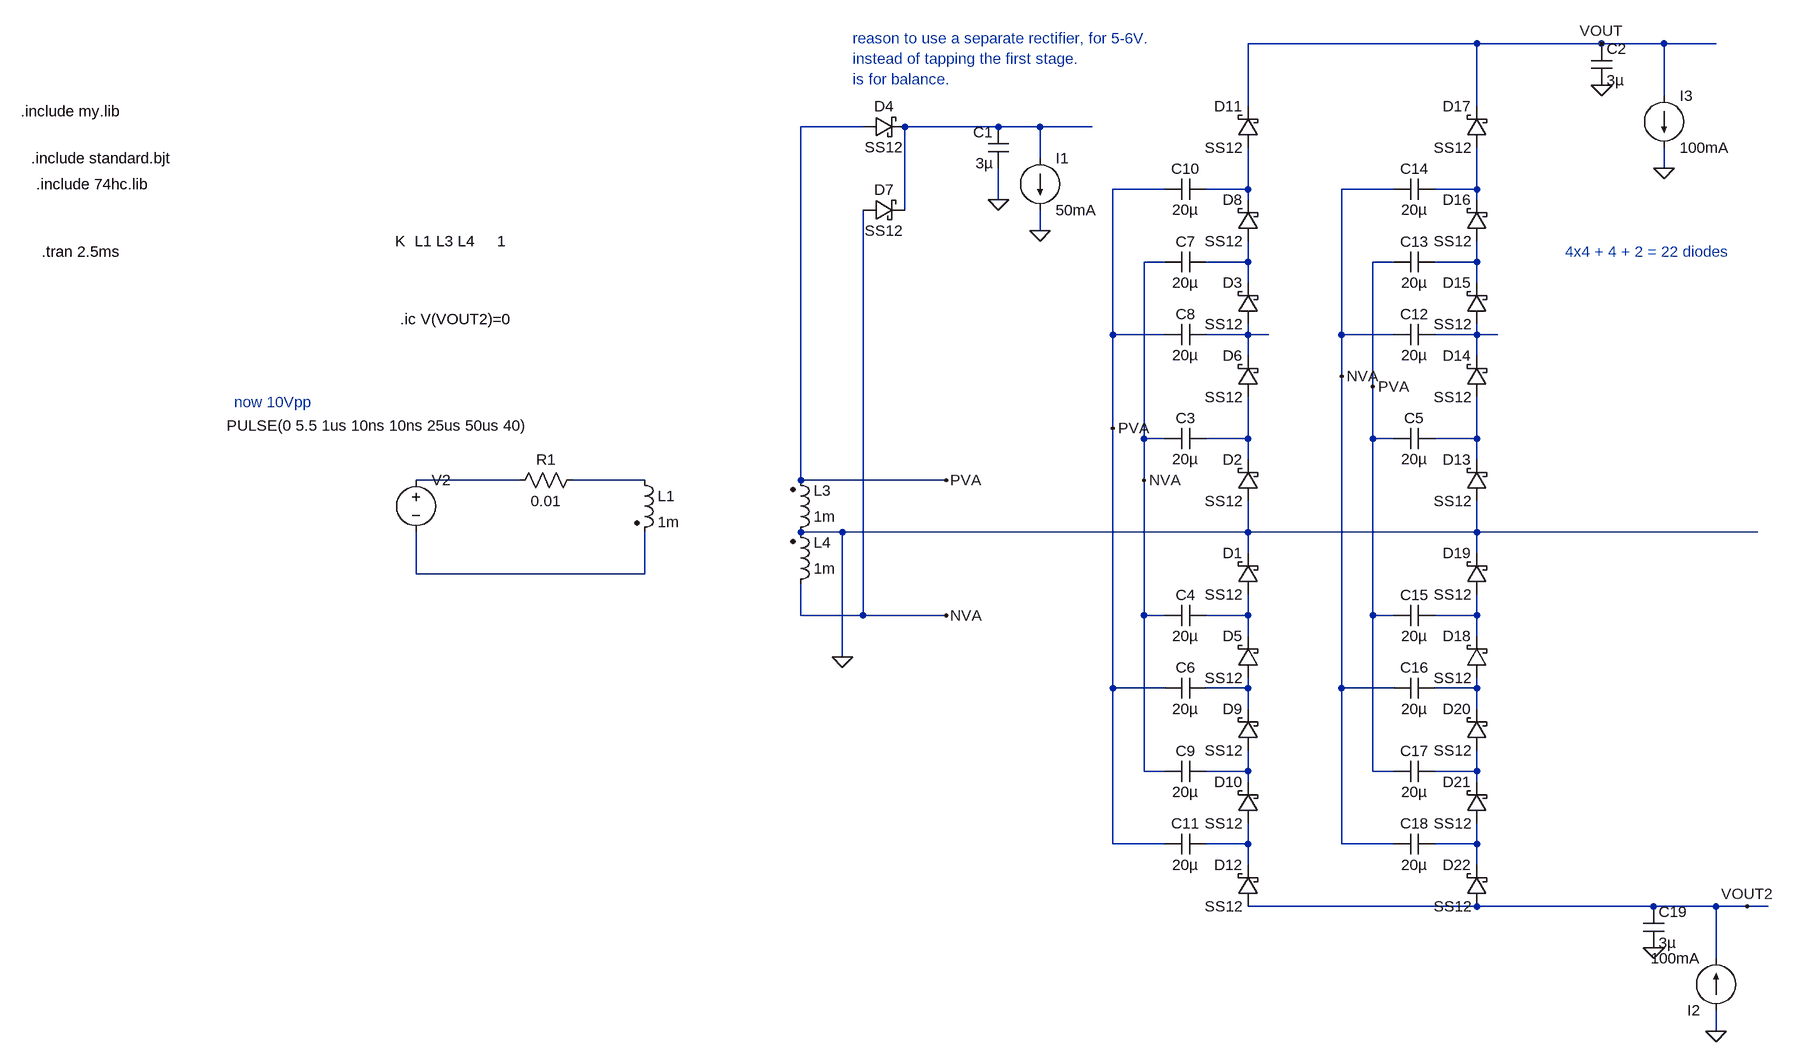
[diagram p0: schematic Draft103.asc]
Draft103.asc, the LTspice schematic file:
Version 4
SHEET 1 5720 1740
WIRE 2784 -800 2432 -800
WIRE 2976 -800 2784 -800
WIRE 3072 -800 2976 -800
WIRE 3152 -800 3072 -800
WIRE 3072 -720 3072 -800
WIRE 2432 -704 2432 -800
WIRE 2784 -704 2784 -800
WIRE 1840 -672 1744 -672
WIRE 2048 -672 1904 -672
WIRE 2112 -672 2048 -672
WIRE 2192 -672 2112 -672
WIRE 2112 -624 2112 -672
WIRE 3072 -608 3072 -640
WIRE 2304 -576 2224 -576
WIRE 2432 -576 2432 -640
WIRE 2432 -576 2368 -576
WIRE 2656 -576 2576 -576
WIRE 2784 -576 2784 -640
WIRE 2784 -576 2720 -576
WIRE 2048 -560 2048 -608
WIRE 2432 -560 2432 -576
WIRE 2784 -560 2784 -576
WIRE 1904 -544 1904 -672
WIRE 2112 -512 2112 -544
WIRE 2304 -464 2272 -464
WIRE 2432 -464 2432 -496
WIRE 2432 -464 2368 -464
WIRE 2656 -464 2624 -464
WIRE 2784 -464 2784 -496
WIRE 2784 -464 2720 -464
WIRE 2432 -432 2432 -464
WIRE 2784 -432 2784 -464
WIRE 2224 -352 2224 -576
WIRE 2304 -352 2224 -352
WIRE 2432 -352 2432 -368
WIRE 2432 -352 2368 -352
WIRE 2464 -352 2432 -352
WIRE 2576 -352 2576 -576
WIRE 2656 -352 2576 -352
WIRE 2784 -352 2784 -368
WIRE 2784 -352 2720 -352
WIRE 2816 -352 2784 -352
WIRE 2432 -320 2432 -352
WIRE 2784 -320 2784 -352
WIRE 2576 -288 2576 -352
WIRE 2624 -272 2624 -464
WIRE 2224 -208 2224 -352
WIRE 2272 -192 2272 -464
WIRE 2304 -192 2272 -192
WIRE 2432 -192 2432 -256
WIRE 2432 -192 2368 -192
WIRE 2624 -192 2624 -272
WIRE 2656 -192 2624 -192
WIRE 2784 -192 2784 -256
WIRE 2784 -192 2720 -192
WIRE 2432 -160 2432 -192
WIRE 2784 -160 2784 -192
WIRE 1312 -128 1152 -128
WIRE 1504 -128 1392 -128
WIRE 1744 -128 1744 -672
WIRE 1968 -128 1744 -128
WIRE 2272 -128 2272 -192
WIRE 1808 -48 1744 -48
WIRE 2432 -48 2432 -96
WIRE 2432 -48 1808 -48
WIRE 2784 -48 2784 -96
WIRE 2784 -48 2432 -48
WIRE 3216 -48 2784 -48
WIRE 2432 -16 2432 -48
WIRE 2784 -16 2784 -48
WIRE 1152 16 1152 -48
WIRE 1504 16 1504 -48
WIRE 1504 16 1152 16
WIRE 1744 80 1744 32
WIRE 1840 80 1840 -544
WIRE 1840 80 1744 80
WIRE 1968 80 1840 80
WIRE 2272 80 2272 -128
WIRE 2304 80 2272 80
WIRE 2432 80 2432 48
WIRE 2432 80 2368 80
WIRE 2624 80 2624 -192
WIRE 2656 80 2624 80
WIRE 2784 80 2784 48
WIRE 2784 80 2720 80
WIRE 2432 112 2432 80
WIRE 2784 112 2784 80
WIRE 1808 144 1808 -48
WIRE 2224 192 2224 -208
WIRE 2304 192 2224 192
WIRE 2432 192 2432 176
WIRE 2432 192 2368 192
WIRE 2576 192 2576 -288
WIRE 2656 192 2576 192
WIRE 2784 192 2784 176
WIRE 2784 192 2720 192
WIRE 2432 224 2432 192
WIRE 2784 224 2784 192
WIRE 2272 320 2272 80
WIRE 2304 320 2272 320
WIRE 2432 320 2432 288
WIRE 2432 320 2368 320
WIRE 2624 320 2624 80
WIRE 2656 320 2624 320
WIRE 2784 320 2784 288
WIRE 2784 320 2720 320
WIRE 2432 336 2432 320
WIRE 2784 336 2784 320
WIRE 2224 432 2224 192
WIRE 2304 432 2224 432
WIRE 2432 432 2432 400
WIRE 2432 432 2368 432
WIRE 2576 432 2576 192
WIRE 2656 432 2576 432
WIRE 2784 432 2784 400
WIRE 2784 432 2720 432
WIRE 2432 464 2432 432
WIRE 2784 464 2784 432
WIRE 2784 528 2432 528
WIRE 3056 528 2784 528
WIRE 3152 528 3056 528
WIRE 3200 528 3152 528
WIRE 3232 528 3200 528
WIRE 3152 608 3152 528
WIRE 3152 720 3152 688
FLAG 1808 144 0
FLAG 2976 -800 VOUT
FLAG 3072 -608 0
FLAG 2048 -560 0
FLAG 2112 -512 0
FLAG 2976 -736 0
FLAG 1968 -128 PVA
FLAG 2224 -208 PVA
FLAG 1968 80 NVA
FLAG 2272 -128 NVA
FLAG 2624 -272 PVA
FLAG 2576 -288 NVA
FLAG 3152 720 0
FLAG 3056 592 0
FLAG 3200 528 VOUT2
SYMBOL ind2 1728 -32 M180
WINDOW 0 36 80 Left 2
WINDOW 3 36 40 Left 2
SYMATTR InstName L3
SYMATTR Value 1m
SYMATTR Type ind
SYMBOL ind2 1728 48 M180
WINDOW 0 36 80 Left 2
WINDOW 3 36 40 Left 2
SYMATTR InstName L4
SYMATTR Value 1m
SYMATTR Type ind
SYMBOL ind2 1488 -144 R0
SYMATTR InstName L1
SYMATTR Value 1m
SYMATTR Type ind
SYMBOL voltage 1152 -144 R0
WINDOW 123 0 0 Left 0
WINDOW 39 0 0 Left 0
WINDOW 3 -291 -68 Left 2
SYMATTR Value PULSE(0 5.5 1us 10ns 10ns 25us 50us 40)
SYMATTR InstName V2
SYMBOL cap 2368 -208 R90
WINDOW 0 0 32 VBottom 2
WINDOW 3 32 32 VTop 2
SYMATTR InstName C3
SYMATTR Value 20µ
SYMBOL cap 2368 64 R90
WINDOW 0 0 32 VBottom 2
WINDOW 3 32 32 VTop 2
SYMATTR InstName C4
SYMATTR Value 20µ
SYMBOL current 3072 -720 R0
WINDOW 123 0 0 Left 0
WINDOW 39 0 0 Left 0
SYMATTR InstName I3
SYMATTR Value 100mA
SYMBOL schottky 2448 -96 R180
WINDOW 0 24 64 Left 2
WINDOW 3 24 0 Left 2
SYMATTR InstName D2
SYMATTR Value SS12
SYMATTR Description Diode
SYMATTR Type diode
SYMBOL schottky 2448 176 R180
WINDOW 0 24 64 Left 2
WINDOW 3 24 0 Left 2
SYMATTR InstName D5
SYMATTR Value SS12
SYMATTR Description Diode
SYMATTR Type diode
SYMBOL schottky 2448 48 R180
WINDOW 0 24 64 Left 2
WINDOW 3 24 0 Left 2
SYMATTR InstName D1
SYMATTR Value SS12
SYMATTR Description Diode
SYMATTR Type diode
SYMBOL schottky 2448 -256 R180
WINDOW 0 24 64 Left 2
WINDOW 3 24 0 Left 2
SYMATTR InstName D6
SYMATTR Value SS12
SYMATTR Description Diode
SYMATTR Type diode
SYMBOL schottky 2448 -368 R180
WINDOW 0 24 64 Left 2
WINDOW 3 24 0 Left 2
SYMATTR InstName D3
SYMATTR Value SS12
SYMATTR Description Diode
SYMATTR Type diode
SYMBOL cap 2368 -368 R90
WINDOW 0 0 32 VBottom 2
WINDOW 3 32 32 VTop 2
SYMATTR InstName C8
SYMATTR Value 20µ
SYMBOL schottky 2448 288 R180
WINDOW 0 24 64 Left 2
WINDOW 3 24 0 Left 2
SYMATTR InstName D9
SYMATTR Value SS12
SYMATTR Description Diode
SYMATTR Type diode
SYMBOL res 1408 -144 R90
WINDOW 0 0 56 VBottom 2
WINDOW 3 32 56 VTop 2
SYMATTR InstName R1
SYMATTR Value 0.01
SYMBOL schottky 1840 -656 R270
WINDOW 0 32 32 VTop 2
WINDOW 3 0 32 VBottom 2
SYMATTR InstName D4
SYMATTR Value SS12
SYMATTR Description Diode
SYMATTR Type diode
SYMBOL schottky 1840 -528 R270
WINDOW 0 32 32 VTop 2
WINDOW 3 0 32 VBottom 2
SYMATTR InstName D7
SYMATTR Value SS12
SYMATTR Description Diode
SYMATTR Type diode
SYMBOL cap 2064 -608 R180
WINDOW 0 24 56 Left 2
WINDOW 3 24 8 Left 2
SYMATTR InstName C1
SYMATTR Value 3µ
SYMBOL current 2112 -624 R0
WINDOW 123 0 0 Left 0
WINDOW 39 0 0 Left 0
SYMATTR InstName I1
SYMATTR Value 50mA
SYMBOL cap 2368 176 R90
WINDOW 0 0 32 VBottom 2
WINDOW 3 32 32 VTop 2
SYMATTR InstName C6
SYMATTR Value 20µ
SYMBOL schottky 2448 -496 R180
WINDOW 0 24 64 Left 2
WINDOW 3 24 0 Left 2
SYMATTR InstName D8
SYMATTR Value SS12
SYMATTR Description Diode
SYMATTR Type diode
SYMBOL cap 2368 -480 R90
WINDOW 0 0 32 VBottom 2
WINDOW 3 32 32 VTop 2
SYMATTR InstName C7
SYMATTR Value 20µ
SYMBOL cap 2368 304 R90
WINDOW 0 0 32 VBottom 2
WINDOW 3 32 32 VTop 2
SYMATTR InstName C9
SYMATTR Value 20µ
SYMBOL schottky 2448 400 R180
WINDOW 0 24 64 Left 2
WINDOW 3 24 0 Left 2
SYMATTR InstName D10
SYMATTR Value SS12
SYMATTR Description Diode
SYMATTR Type diode
SYMBOL cap 2368 -592 R90
WINDOW 0 0 32 VBottom 2
WINDOW 3 32 32 VTop 2
SYMATTR InstName C10
SYMATTR Value 20µ
SYMBOL cap 2368 416 R90
WINDOW 0 0 32 VBottom 2
WINDOW 3 32 32 VTop 2
SYMATTR InstName C11
SYMATTR Value 20µ
SYMBOL schottky 2448 -640 R180
WINDOW 0 24 64 Left 2
WINDOW 3 24 0 Left 2
SYMATTR InstName D11
SYMATTR Value SS12
SYMATTR Description Diode
SYMATTR Type diode
SYMBOL schottky 2448 528 R180
WINDOW 0 24 64 Left 2
WINDOW 3 24 0 Left 2
SYMATTR InstName D12
SYMATTR Value SS12
SYMATTR Description Diode
SYMATTR Type diode
SYMBOL cap 2960 -800 R0
SYMATTR InstName C2
SYMATTR Value 3µ
SYMBOL cap 2720 -208 R90
WINDOW 0 0 32 VBottom 2
WINDOW 3 32 32 VTop 2
SYMATTR InstName C5
SYMATTR Value 20µ
SYMBOL schottky 2800 -96 R180
WINDOW 0 24 64 Left 2
WINDOW 3 24 0 Left 2
SYMATTR InstName D13
SYMATTR Value SS12
SYMATTR Description Diode
SYMATTR Type diode
SYMBOL schottky 2800 -256 R180
WINDOW 0 24 64 Left 2
WINDOW 3 24 0 Left 2
SYMATTR InstName D14
SYMATTR Value SS12
SYMATTR Description Diode
SYMATTR Type diode
SYMBOL schottky 2800 -368 R180
WINDOW 0 24 64 Left 2
WINDOW 3 24 0 Left 2
SYMATTR InstName D15
SYMATTR Value SS12
SYMATTR Description Diode
SYMATTR Type diode
SYMBOL cap 2720 -368 R90
WINDOW 0 0 32 VBottom 2
WINDOW 3 32 32 VTop 2
SYMATTR InstName C12
SYMATTR Value 20µ
SYMBOL schottky 2800 -496 R180
WINDOW 0 24 64 Left 2
WINDOW 3 24 0 Left 2
SYMATTR InstName D16
SYMATTR Value SS12
SYMATTR Description Diode
SYMATTR Type diode
SYMBOL cap 2720 -480 R90
WINDOW 0 0 32 VBottom 2
WINDOW 3 32 32 VTop 2
SYMATTR InstName C13
SYMATTR Value 20µ
SYMBOL cap 2720 -592 R90
WINDOW 0 0 32 VBottom 2
WINDOW 3 32 32 VTop 2
SYMATTR InstName C14
SYMATTR Value 20µ
SYMBOL schottky 2800 -640 R180
WINDOW 0 24 64 Left 2
WINDOW 3 24 0 Left 2
SYMATTR InstName D17
SYMATTR Value SS12
SYMATTR Description Diode
SYMATTR Type diode
SYMBOL cap 2720 64 R90
WINDOW 0 0 32 VBottom 2
WINDOW 3 32 32 VTop 2
SYMATTR InstName C15
SYMATTR Value 20µ
SYMBOL schottky 2800 176 R180
WINDOW 0 24 64 Left 2
WINDOW 3 24 0 Left 2
SYMATTR InstName D18
SYMATTR Value SS12
SYMATTR Description Diode
SYMATTR Type diode
SYMBOL schottky 2800 48 R180
WINDOW 0 24 64 Left 2
WINDOW 3 24 0 Left 2
SYMATTR InstName D19
SYMATTR Value SS12
SYMATTR Description Diode
SYMATTR Type diode
SYMBOL schottky 2800 288 R180
WINDOW 0 24 64 Left 2
WINDOW 3 24 0 Left 2
SYMATTR InstName D20
SYMATTR Value SS12
SYMATTR Description Diode
SYMATTR Type diode
SYMBOL cap 2720 176 R90
WINDOW 0 0 32 VBottom 2
WINDOW 3 32 32 VTop 2
SYMATTR InstName C16
SYMATTR Value 20µ
SYMBOL cap 2720 304 R90
WINDOW 0 0 32 VBottom 2
WINDOW 3 32 32 VTop 2
SYMATTR InstName C17
SYMATTR Value 20µ
SYMBOL schottky 2800 400 R180
WINDOW 0 24 64 Left 2
WINDOW 3 24 0 Left 2
SYMATTR InstName D21
SYMATTR Value SS12
SYMATTR Description Diode
SYMATTR Type diode
SYMBOL cap 2720 416 R90
WINDOW 0 0 32 VBottom 2
WINDOW 3 32 32 VTop 2
SYMATTR InstName C18
SYMATTR Value 20µ
SYMBOL schottky 2800 528 R180
WINDOW 0 24 64 Left 2
WINDOW 3 24 0 Left 2
SYMATTR InstName D22
SYMATTR Value SS12
SYMATTR Description Diode
SYMATTR Type diode
SYMBOL current 3152 688 R180
WINDOW 123 0 0 Left 0
WINDOW 39 0 0 Left 0
SYMATTR InstName I2
SYMATTR Value 100mA
SYMBOL cap 3040 528 R0
SYMATTR InstName C19
SYMATTR Value 3µ
TEXT 576 -480 Left 2 !.tran 2.5ms
TEXT 1120 -496 Left 2 !K  L1 L3 L4     1
TEXT 560 -624 Left 2 !.include standard.bjt
TEXT 544 -696 Left 2 !.include my.lib
TEXT 568 -584 Left 2 !.include 74hc.lib
TEXT 872 -248 Left 2 ;now 10Vpp
TEXT 1824 -808 Left 2 ;reason to use a separate rectifier, for 5-6V.\ninstead of tapping the first stage.\nis for balance.
TEXT 1128 -376 Left 2 !.ic V(VOUT2)=0
TEXT 2920 -480 Left 2 ;4x4 + 4 + 2 = 22 diodes

The netlist it stands for:
* Draft103.asc
L3 0 PVA 1m
L4 NVA 0 1m
L1 N011 N012 1m
V2 N010 N012 PULSE(0 5.5 1us 10ns 10ns 25us 50us 40)
C3 N008 NVA 20µ
C4 N013 NVA 20µ
I3 VOUT 0 100mA
D2 0 N008 SS12
D5 N015 N013 SS12
D1 N013 0 SS12
D6 N008 N006 SS12
D3 N006 N004 SS12
C8 N006 PVA 20µ
D9 N017 N015 SS12
R1 N011 N010 0.01
D4 PVA N001 SS12
D7 NVA N001 SS12
C1 0 N001 3µ
I1 N001 0 50mA
C6 N015 PVA 20µ
D8 N004 N002 SS12
C7 N004 NVA 20µ
C9 N017 NVA 20µ
D10 N019 N017 SS12
C10 N002 PVA 20µ
C11 N019 PVA 20µ
D11 N002 VOUT SS12
D12 VOUT2 N019 SS12
C2 VOUT 0 3µ
C5 N009 PVA 20µ
D13 0 N009 SS12
D14 N009 N007 SS12
D15 N007 N005 SS12
C12 N007 NVA 20µ
D16 N005 N003 SS12
C13 N005 PVA 20µ
C14 N003 NVA 20µ
D17 N003 VOUT SS12
C15 N014 PVA 20µ
D18 N016 N014 SS12
D19 N014 0 SS12
D20 N018 N016 SS12
C16 N016 NVA 20µ
C17 N018 PVA 20µ
D21 N020 N018 SS12
C18 N020 NVA 20µ
D22 VOUT2 N020 SS12
I2 0 VOUT2 100mA
C19 VOUT2 0 3µ
.model D D
.lib standard.dio
.tran 2.5ms
K  L1 L3 L4     1
.include standard.bjt
.include my.lib
.include 74hc.lib
* now 10Vpp
* reason to use a separate rectifier, for 5-6V.
* instead of tapping the first stage.
* is for balance.
.ic V(VOUT2)=0
* 4x4 + 4 + 2 = 22 diodes
.backanno
.end